# Altium project 2113B_DeElectronique.PrjPcb
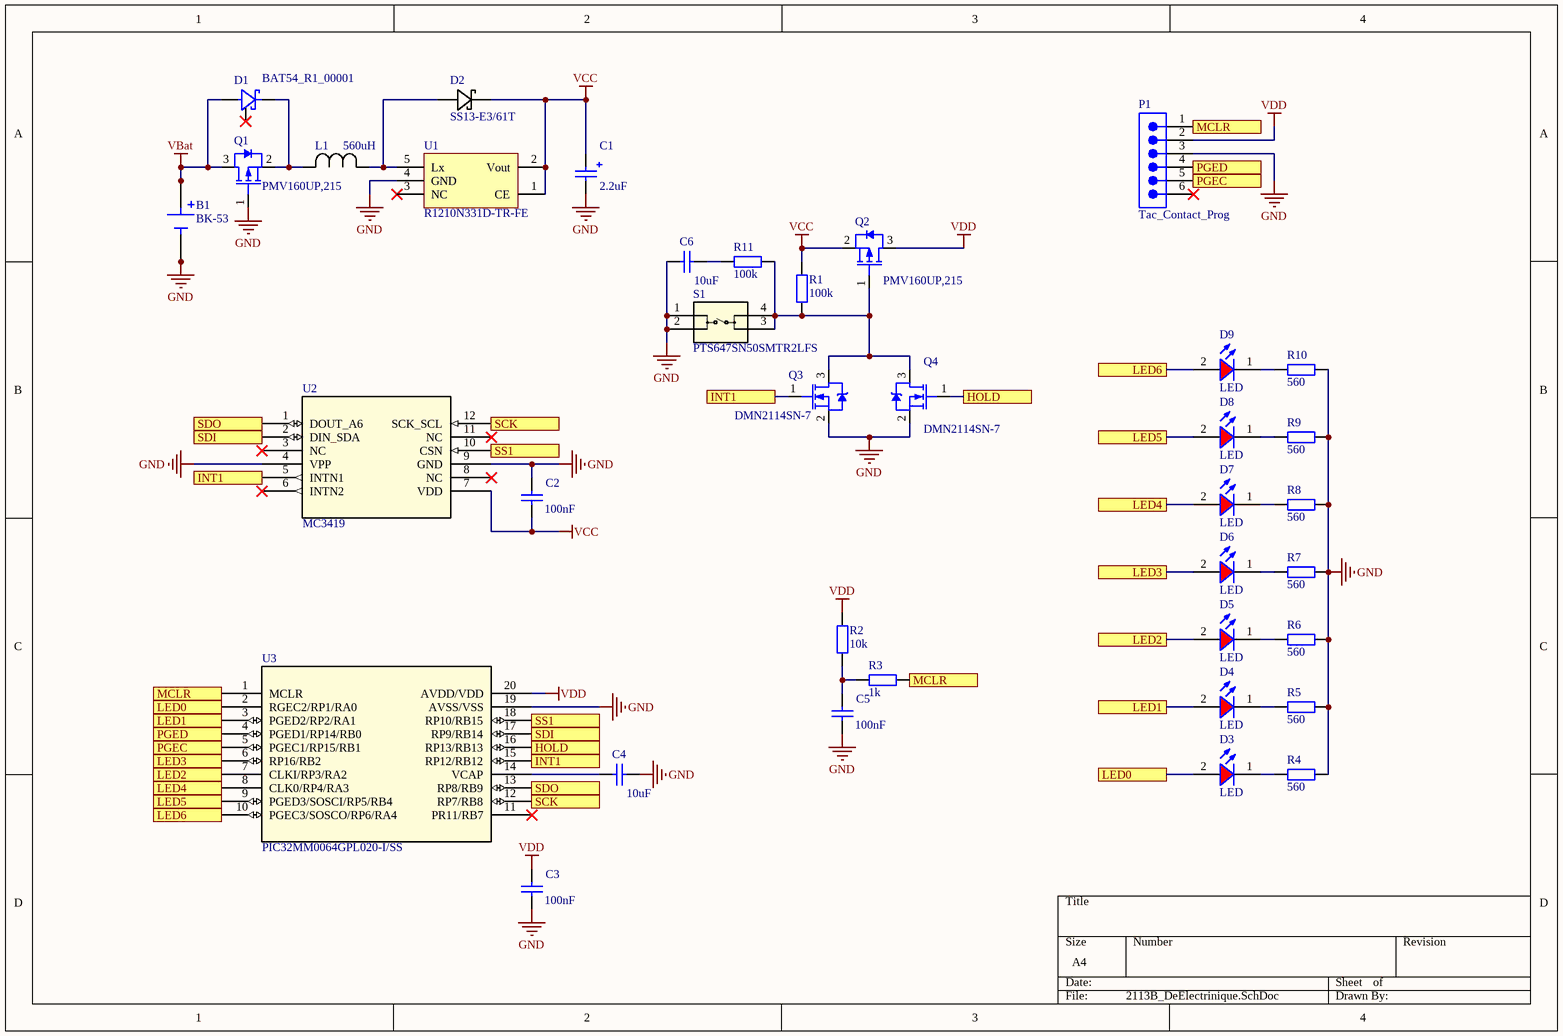
[diagram p0: 2113B_DeElectrinique.SchDoc]
1 sheet, 37 parts. Net scope: flat (ports and power ports of the same name join across sheets).
Board file: 2113B_DeElectronique.PcbDoc

## Sheet 2113B_DeElectrinique.SchDoc
size A4

### Parts
B1  BK-53  [BK-53]
C1  2.2uF  [Condo_0805]
C2  100nF  [Condo_0805]
C3  100nF  [Condo_0805]
C4  10uF  [Condo_0805]
C5  100nF  [Condo_0805]
C6  10uF  [Condo_0805]
D1  BAT54_R1_00001  [SOT23-3]
D2  SS13-E3/61T  [DO-214AC]
D3  LED  [LED_0805]
D4  LED  [LED_0805]
D5  LED  [LED_0805]
D6  LED  [LED_0805]
D7  LED  [LED_0805]
D8  LED  [LED_0805]
D9  LED  [LED_0805]
L1  560uH  [self 1206 (3225)]
P1  Tac_Contact_Prog  [TAC_Contact_Prog]
Q1  PMV160UP,215  [SOT23-3]
Q2  PMV160UP,215  [SOT23-3]
Q3  DMN2114SN-7  [SOT23-3]
Q4  DMN2114SN-7  [SOT23-3]
R1  100k  [Res_0805]
R2  10k  [Res_0805]
R3  1k  [Res_0805]
R4  560  [Res_0805]
R5  560  [Res_0805]
R6  560  [Res_0805]
R7  560  [Res_0805]
R8  560  [Res_0805]
R9  560  [Res_0805]
R10  560  [Res_0805]
R11  100k  [Res_0805]
S1  PTS647SN50SMTR2LFS  [PTS647SN50SMTR2LFS]
U1  R1210N331D-TR-FE  [SOT23-5]
U2  MC3419  [MC3419]
U3  PIC32MM0064GPL020-I/SS  [SSOP20_SS_MCH]

### Ports
HOLD, INT1, LED0, LED1, LED2, LED3, LED4, LED5, LED6, MCLR, PGEC, PGED, SCK, SDI, SDO, SS1

### Nets
GND: B1.1-(NEG) B1.2-(NEG) C1.2 C2.2 C3.1 C4.2 C5.1 C6.1 P1.3 Q1.1(GATE) Q3.2(S) Q4.2(S) R4.2 R5.2 R6.2 R7.2 R8.2 R9.2 R10.2 S1.1 S1.2 U1.4(GND) U2.4(VPP) U2.9(GND) U3.19(AVSS/VSS)
VBat: B1.1+(POS) B1.2+(POS) D1.1 Q1.3(DRAIN)
VCC: C1.1 C2.1 D2.1 Q2.2(SOURCE) R1.2 U1.1(CE) U1.2(Vout) U2.7(VDD)
VDD: C3.2 P1.2 Q2.3(DRAIN) R2.2 U3.20(AVDD/VDD)
NetC4_1: C4.1 U3.14(VCAP)
NetC5_2: C5.2 R2.1 R3.1
NetC6_2: C6.2 R11.1
NetD1_3: D1.3 L1.2 Q1.2(SOURCE)
NetD2_2: D2.2 L1.1 U1.5(Lx)
NetD3_1: D3.1(K) R4.1
NetD3_2: D3.2(A) U3.2(RGEC2/RP1/RA0) ; port LED0
NetD4_1: D4.1(K) R5.1
NetD4_2: D4.2(A) U3.3(PGED2/RP2/RA1) ; port LED1
NetD5_1: D5.1(K) R6.1
NetD5_2: D5.2(A) U3.7(CLKI/RP3/RA2) ; port LED2
NetD6_1: D6.1(K) R7.1
NetD6_2: D6.2(A) U3.6(RP16/RB2) ; port LED3
NetD7_1: D7.1(K) R8.1
NetD7_2: D7.2(A) U3.8(CLK0/RP4/RA3) ; port LED4
NetD8_1: D8.1(K) R9.1
NetD8_2: D8.2(A) U3.9(PGED3/SOSCI/RP5/RB4) ; port LED5
NetD9_1: D9.1(K) R10.1
NetD9_2: D9.2(A) U3.10(PGEC3/SOSCO/RP6/RA4) ; port LED6
NetP1_1: P1.1 R3.2 U3.1(MCLR) ; port MCLR
NetP1_4: P1.4 U3.4(PGED1/RP14/RB0) ; port PGED
NetP1_5: P1.5 U3.5(PGEC1/RP15/RB1) ; port PGEC
NetQ2_1: Q2.1(GATE) Q3.3(D) Q4.3(D) R1.1 R11.2 S1.3 S1.4
NetQ3_1: Q3.1(G) U2.5(INTN1) U3.15(RP12/RB12) ; port INT1
NetQ4_1: Q4.1(G) U3.16(RP13/RB13) ; port HOLD
NetU2_1: U2.1(DOUT_A6) U3.13(RP8/RB9) ; port SDO
NetU2_2: U2.2(DIN_SDA) U3.17(RP9/RB14) ; port SDI
NetU2_10: U2.10(CSN) U3.18(RP10/RB15) ; port SS1
NetU2_12: U2.12(SCK_SCL) U3.12(RP7/RB8) ; port SCK

Not connected (* = marked no-connect by the designer): D1 2*; P1 6*; U1 3(NC)*; U2 3(NC)* 6(INTN2)* 8(NC)* 11(NC)*; U3 11(PR11/RB7)*

### Library data of the parts
B1 = BK-53: BATT CONTACT CLIP AA 1 CELL SMD; Manufacturer: MPD (Memory Protection Devices); ManufacturerPart: BK-53; Supplier: Digi-Key; SupplierPart: BK-53-ND
C1 = Condensateur_Pol: Manufacturer: Samsung Electro-Mechanics; ManufacturerPart: CL21B225KPFNNNG; Supplier: Mouser; SupplierPart: 187-CL21B225KPFNNNG
C2 C3 C5 = Condensateur: Manufacturer: KEMET; ManufacturerPart: C0805C104K5RAC7411; Supplier: Mouser; SupplierPart: 80-C0805C104K5RACLR
C4 C6 = Condensateur: Manufacturer: Samsung Electro-Mechanics; ManufacturerPart: CL21A106KOCLRNC; Supplier: Mouser; SupplierPart: 187-CL21A106KOCLRNC
D1 = BAT54_R1_00001: Manufacturer: Panjit; ManufacturerPart: BAT54_R1_00001; Supplier: Mouser; SupplierPart: 241-BAT54_R1_00001
D2 = Schottky: Manufacturer: Vishay; ManufacturerPart: SS13-E3/61T; Supplier: Mouser; SupplierPart: 625-SS13-E3
D3-D9 = LED: DEL standard - CMS 2.0X1.2MM LOW CRNT; Manufacturer: Kingbright; ManufacturerPart: APT2012LSECK/J3-PRV; Supplier: Mouser; SupplierPart: 604-APT2012LSECKJ3RV
L1 = Self: Manufacturer: Murata Electronics; ManufacturerPart: LQH32CN561K23L; Supplier: Mouser; SupplierPart: 81-LQH32CN561K23L
P1 = Tac_Contact_Prog: Tac contact pour programmation
Q1 Q2 = MOSFET-P: Manufacturer: Nexperia; ManufacturerPart: PMV160UP,215; Supplier: Mouser; SupplierPart: 771-PMV160UP215
Q3 Q4 = MOSFET-N: Manufacturer: Diodes Incorporated; ManufacturerPart: DMN2114SN-7; Supplier: Mouser; SupplierPart: 621-DMN2114SN-7
R1 R11 = Résistance: Manufacturer: Vishay / Beyschlag; ManufacturerPart: MCS04020D1003BE000; Supplier: Mouser; SupplierPart: 594-MCS04020D1003BE0
R2 = Résistance: Manufacturer: Stackpole Electronics Inc; ManufacturerPart: RMCF0805JT10K0; Supplier: Digi-Key; SupplierPart: RMCF0805JT10K0CT-ND
R3 = Résistance: Manufacturer: Stackpole Electronics Inc; ManufacturerPart: RNCP0805FTD1K00; Supplier: Digi-Key; SupplierPart: RNCP0805FTD1K00CT-ND
R4-R10 = Résistance: Manufacturer: Panasonic; ManufacturerPart: ERA-6AED561V; Supplier: Mouser; SupplierPart: 667-ERA-6AED561V
S1 = Bouton: Interrupteurs de contact 50mA 12VDC, 1.0N 5.0mm H, G leads; Manufacturer: C&K; ManufacturerPart: PTS647SN50SMTR2LFS; Supplier: Mouser; SupplierPart: 611-PTS647SN50SMTR2L
U1 = R1210N331D-TR-FE: Régulateurs de tension de commutation 8V Input PWM Step-up DCDC Converter; Manufacturer: Ricoh Electronic Devices Company; ManufacturerPart: R1210N331D-TR-FE; Supplier: Digi-Key; SupplierPart: 2129-R1210N331D-TR-FECT-ND
U2 = MC3419: Accéléromètres Small Digital 3-axis Accelerometer Sensor; Manufacturer: MEMSIC; ManufacturerPart: MC3419; Supplier: Mouser; SupplierPart: 498-MC3419
U3 = PIC32MM0064GPL020-I/SS: Microcontrôleurs 32 bits - MCU 8KB RAM 79 Power microMIPS; Manufacturer: MicroChip; ManufacturerPart: PIC32MM0064GPL020-I/SS; Supplier: Mouser; SupplierPart: 579-MM0064GPL020ISS